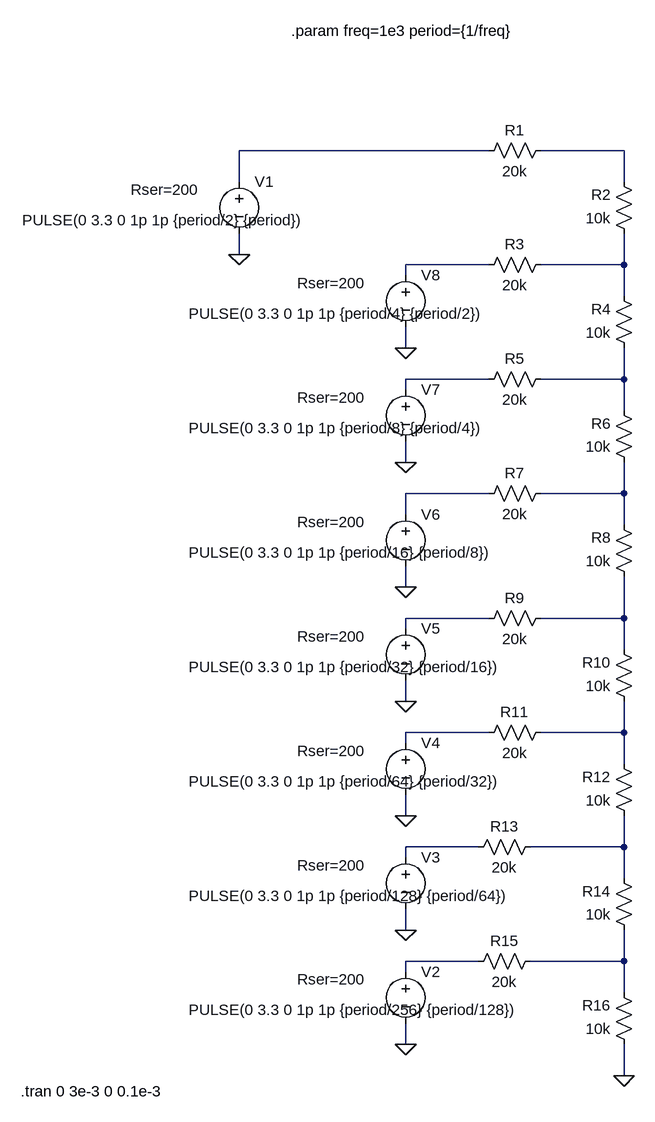
[diagram p0: schematic R2R-ladder_binary-counter-input.asc]
R2R-ladder_binary-counter-input.asc, the LTspice schematic file:
Version 4
SHEET 1 880 1512
WIRE 160 48 -224 48
WIRE 368 48 240 48
WIRE -224 96 -224 48
WIRE 368 96 368 48
WIRE -224 208 -224 176
WIRE 160 224 32 224
WIRE 368 224 368 176
WIRE 368 224 240 224
WIRE 32 240 32 224
WIRE 368 272 368 224
WIRE 32 352 32 320
WIRE 160 400 32 400
WIRE 368 400 368 352
WIRE 368 400 240 400
WIRE 32 416 32 400
WIRE 368 448 368 400
WIRE 32 528 32 496
WIRE 160 576 32 576
WIRE 368 576 368 528
WIRE 368 576 240 576
WIRE 32 608 32 576
WIRE 368 624 368 576
WIRE 32 720 32 688
WIRE 160 768 32 768
WIRE 368 768 368 704
WIRE 368 768 240 768
WIRE 32 784 32 768
WIRE 368 816 368 768
WIRE 32 896 32 864
WIRE 160 944 32 944
WIRE 368 944 368 896
WIRE 368 944 240 944
WIRE 32 960 32 944
WIRE 368 992 368 944
WIRE 32 1072 32 1040
WIRE 144 1120 32 1120
WIRE 368 1120 368 1072
WIRE 368 1120 224 1120
WIRE 32 1136 32 1120
WIRE 368 1168 368 1120
WIRE 32 1248 32 1216
WIRE 144 1296 32 1296
WIRE 368 1296 368 1248
WIRE 368 1296 224 1296
WIRE 32 1312 32 1296
WIRE 368 1344 368 1296
WIRE 32 1424 32 1392
WIRE 368 1472 368 1424
FLAG 368 1472 0
FLAG -224 208 0
FLAG 32 1424 0
FLAG 32 1248 0
FLAG 32 1072 0
FLAG 32 896 0
FLAG 32 720 0
FLAG 32 528 0
FLAG 32 352 0
SYMBOL res 256 32 R90
WINDOW 0 0 56 VBottom 2
WINDOW 3 32 56 VTop 2
SYMATTR InstName R1
SYMATTR Value 20k
SYMBOL res 384 192 R180
WINDOW 0 36 76 Left 2
WINDOW 3 36 40 Left 2
SYMATTR InstName R2
SYMATTR Value 10k
SYMBOL res 256 208 R90
WINDOW 0 0 56 VBottom 2
WINDOW 3 32 56 VTop 2
SYMATTR InstName R3
SYMATTR Value 20k
SYMBOL res 384 368 R180
WINDOW 0 36 76 Left 2
WINDOW 3 36 40 Left 2
SYMATTR InstName R4
SYMATTR Value 10k
SYMBOL res 256 384 R90
WINDOW 0 0 56 VBottom 2
WINDOW 3 32 56 VTop 2
SYMATTR InstName R5
SYMATTR Value 20k
SYMBOL res 384 544 R180
WINDOW 0 36 76 Left 2
WINDOW 3 36 40 Left 2
SYMATTR InstName R6
SYMATTR Value 10k
SYMBOL res 256 560 R90
WINDOW 0 0 56 VBottom 2
WINDOW 3 32 56 VTop 2
SYMATTR InstName R7
SYMATTR Value 20k
SYMBOL res 384 720 R180
WINDOW 0 36 76 Left 2
WINDOW 3 36 40 Left 2
SYMATTR InstName R8
SYMATTR Value 10k
SYMBOL res 256 752 R90
WINDOW 0 0 56 VBottom 2
WINDOW 3 32 56 VTop 2
SYMATTR InstName R9
SYMATTR Value 20k
SYMBOL res 384 912 R180
WINDOW 0 36 76 Left 2
WINDOW 3 36 40 Left 2
SYMATTR InstName R10
SYMATTR Value 10k
SYMBOL res 256 928 R90
WINDOW 0 0 56 VBottom 2
WINDOW 3 32 56 VTop 2
SYMATTR InstName R11
SYMATTR Value 20k
SYMBOL res 384 1088 R180
WINDOW 0 36 76 Left 2
WINDOW 3 36 40 Left 2
SYMATTR InstName R12
SYMATTR Value 10k
SYMBOL res 240 1104 R90
WINDOW 0 0 56 VBottom 2
WINDOW 3 32 56 VTop 2
SYMATTR InstName R13
SYMATTR Value 20k
SYMBOL res 384 1264 R180
WINDOW 0 36 76 Left 2
WINDOW 3 36 40 Left 2
SYMATTR InstName R14
SYMATTR Value 10k
SYMBOL res 240 1280 R90
WINDOW 0 0 56 VBottom 2
WINDOW 3 32 56 VTop 2
SYMATTR InstName R15
SYMATTR Value 20k
SYMBOL res 384 1440 R180
WINDOW 0 36 76 Left 2
WINDOW 3 36 40 Left 2
SYMATTR InstName R16
SYMATTR Value 10k
SYMBOL voltage -224 80 R0
WINDOW 3 -334 75 Left 2
WINDOW 123 0 0 Left 0
WINDOW 39 -167 28 Left 2
SYMATTR InstName V1
SYMATTR Value PULSE(0 3.3 0 1p 1p {period/2} {period})
SYMATTR SpiceLine Rser=200
SYMBOL voltage 32 1296 R0
WINDOW 3 -334 75 Left 2
WINDOW 123 0 0 Left 0
WINDOW 39 -167 28 Left 2
SYMATTR InstName V2
SYMATTR Value PULSE(0 3.3 0 1p 1p {period/256} {period/128})
SYMATTR SpiceLine Rser=200
SYMBOL voltage 32 1120 R0
WINDOW 3 -334 75 Left 2
WINDOW 123 0 0 Left 0
WINDOW 39 -167 28 Left 2
SYMATTR InstName V3
SYMATTR Value PULSE(0 3.3 0 1p 1p {period/128} {period/64})
SYMATTR SpiceLine Rser=200
SYMBOL voltage 32 944 R0
WINDOW 3 -334 75 Left 2
WINDOW 123 0 0 Left 0
WINDOW 39 -167 28 Left 2
SYMATTR InstName V4
SYMATTR Value PULSE(0 3.3 0 1p 1p {period/64} {period/32})
SYMATTR SpiceLine Rser=200
SYMBOL voltage 32 768 R0
WINDOW 3 -334 75 Left 2
WINDOW 123 0 0 Left 0
WINDOW 39 -167 28 Left 2
SYMATTR InstName V5
SYMATTR Value PULSE(0 3.3 0 1p 1p {period/32} {period/16})
SYMATTR SpiceLine Rser=200
SYMBOL voltage 32 592 R0
WINDOW 3 -334 75 Left 2
WINDOW 123 0 0 Left 0
WINDOW 39 -167 28 Left 2
SYMATTR InstName V6
SYMATTR Value PULSE(0 3.3 0 1p 1p {period/16} {period/8})
SYMATTR SpiceLine Rser=200
SYMBOL voltage 32 400 R0
WINDOW 3 -334 75 Left 2
WINDOW 123 0 0 Left 0
WINDOW 39 -167 28 Left 2
SYMATTR InstName V7
SYMATTR Value PULSE(0 3.3 0 1p 1p {period/8} {period/4})
SYMATTR SpiceLine Rser=200
SYMBOL voltage 32 224 R0
WINDOW 3 -334 75 Left 2
WINDOW 123 0 0 Left 0
WINDOW 39 -167 28 Left 2
SYMATTR InstName V8
SYMATTR Value PULSE(0 3.3 0 1p 1p {period/4} {period/2})
SYMATTR SpiceLine Rser=200
TEXT -144 -136 Left 2 !.param freq=1e3 period={1/freq}
TEXT -560 1496 Left 2 !.tran 0 3e-3 0 0.1e-3

The netlist it stands for:
* R2R-ladder_binary-counter-input.asc
R1 N002 N001 20k
R2 N004 N002 10k
R3 N004 N003 20k
R4 N006 N004 10k
R5 N006 N005 20k
R6 N008 N006 10k
R7 N008 N007 20k
R8 N010 N008 10k
R9 N010 N009 20k
R10 N012 N010 10k
R11 N012 N011 20k
R12 N014 N012 10k
R13 N014 N013 20k
R14 N016 N014 10k
R15 N016 N015 20k
R16 0 N016 10k
V1 N001 0 PULSE(0 3.3 0 1p 1p {period/2} {period}) Rser=200
V2 N015 0 PULSE(0 3.3 0 1p 1p {period/256} {period/128}) Rser=200
V3 N013 0 PULSE(0 3.3 0 1p 1p {period/128} {period/64}) Rser=200
V4 N011 0 PULSE(0 3.3 0 1p 1p {period/64} {period/32}) Rser=200
V5 N009 0 PULSE(0 3.3 0 1p 1p {period/32} {period/16}) Rser=200
V6 N007 0 PULSE(0 3.3 0 1p 1p {period/16} {period/8}) Rser=200
V7 N005 0 PULSE(0 3.3 0 1p 1p {period/8} {period/4}) Rser=200
V8 N003 0 PULSE(0 3.3 0 1p 1p {period/4} {period/2}) Rser=200
.param freq=1e3 period={1/freq}
.tran 0 3e-3 0 0.1e-3
.backanno
.end